# EAGLE design encoder (EAGLE 6.4)
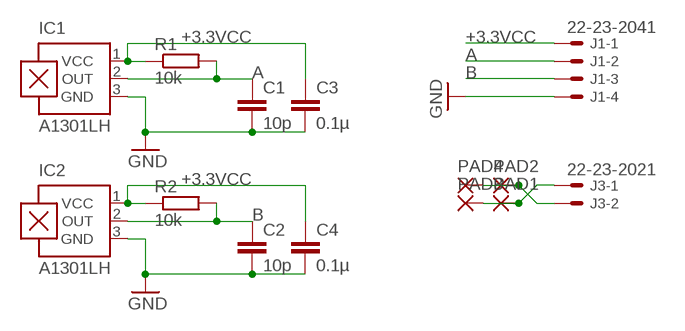
[diagram p0: schematic, sheet 1]

## Parts
C1  10p  C-EUC0805  [C0805]
C2  10p  C-EUC0805  [C0805]
C3  0.1µ  C-EUC0805  [C0805]
C4  0.1µ  C-EUC0805  [C0805]
IC1  A1301LH  [SOT23-W]
IC2  A1301LH  [SOT23-W]
J1  22-23-2041  [22-23-2041]
J3  22-23-2021  [22-23-2021]
PAD1  3,81/1,4  [3,81/1,4]
PAD2  3,81/1,4  [3,81/1,4]
PAD3  3,81/1,4  [3,81/1,4]
PAD4  3,81/1,4  [3,81/1,4]
R1  10k  R-EU_R0805  [R0805]
R2  10k  R-EU_R0805  [R0805]

## Nets
+3.3VCC: C3.1 C4.1 IC1.1(VCC) IC2.1(VCC) J1.1 R1.1 R2.1
A: C1.1 IC1.2(OUT) J1.2 R1.2
B: C2.1 IC2.2(OUT) J1.3 R2.2
GND: C1.2 C2.2 C3.2 C4.2 IC1.3(GND) IC2.3(GND) J1.4
N$9: J3.1 PAD1.1(P) PAD3.1(P)
N$17: J3.2 PAD2.1(P) PAD4.1(P)

## Library data of the parts
C1-C4 = rcl:C-EU: CAPACITOR, European symbol
IC1 IC2 = allegro:A13*?: Linear Hall Effect Sensor ICs Continuous-Time Ratiometric High-Temperature Operation Programmable Linear with Analog Output A1302 -Replacement- UGN3503 Source: http://www.allegromicro.com/en/Products/Part_Numbers/1301/1301.pdf http://www.allegromicro.com/en/Products/Part_Numbers/1321/1321.pdf http://www.allegromicro.com/en/Products/Part_Numbers/1381/1381.pdf; MF: ALLEGRO MICROSYSTEMS, INC.; MPN: A1301ELHLT-T; OC_FARNELL: 1198084; OC_NEWARK: 31K6634
J1 = con-molex:22-23-2041: .100" (2.54mm) Center Header - 4 Pin; MF: MOLEX; MPN: 22-23-2041; OC_FARNELL: 1462920; OC_NEWARK: 38C0355
J3 = con-molex:22-23-2021: .100" (2.54mm) Center Header - 2 Pin; MF: MOLEX; MPN: 22-23-2021; OC_FARNELL: 1462926; OC_NEWARK: 25C3832
PAD1-PAD4 = wirepad:3,81/1,4: THROUGH-HOLE PAD
R1 R2 = rcl:R-EU_: RESISTOR, European symbol

## Net classes
0 default: clearance 0.355 mm

## Board
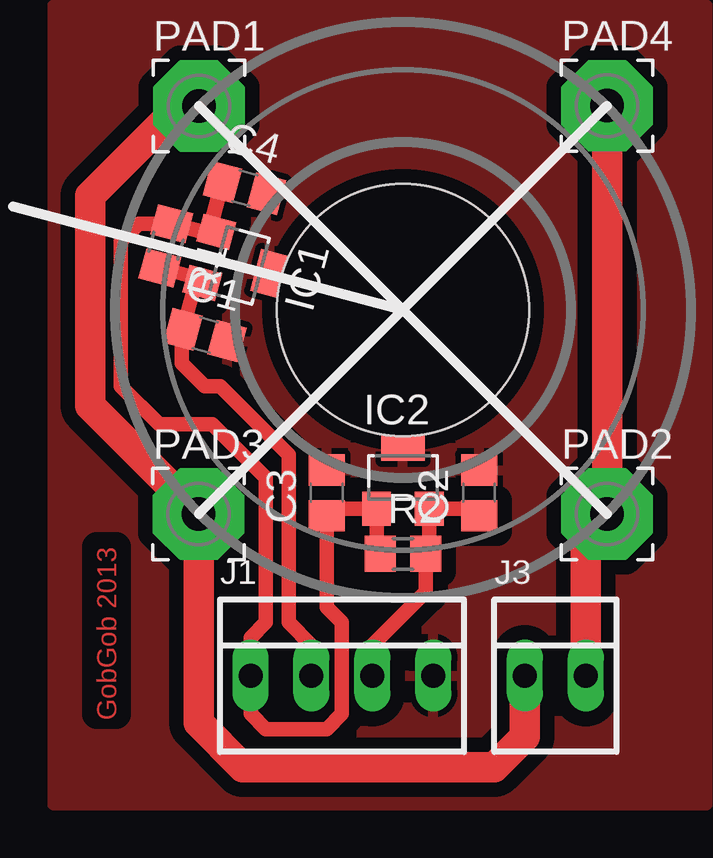
[diagram p1: board, top side]

No outline drawn. Coordinates in mm, seen from the top.
Copper layers (1*2*15*16): Top 0.035mm / dielectric 0.2mm / Route2 0.0175mm / dielectric 1.1mm / Route15 0.0175mm / dielectric 0.2mm / Bottom 0.035mm
Design rules "SeeedStudio_DRU_no_angle_20130527": minimum track width 6mil, minimum drill 12mil, track to track 6mil, track to pad 6mil, pad to pad 6mil, via to via 6mil, smd to smd 0mil, copper to edge 10mil, drill to drill 10mil, minimum pad ring 6mil, minimum via ring 6mil, stop-mask expansion 2mil, vias tented up to drill 25mil, thermal gap 10mil
Holes 10.5 mm at 1.27,-6.35

### Footprints (pad centres in the part's own frame; a part is rotated, then mirrored left to right if it is on the bottom)
C0805 = smd 1.3 x 1.5: 1 -0.95,0; 2 0.95,0
SOT23-W = smd 1.2 x 1.4: 1 -1.1,-1.3; 2 1.1,-1.3 | smd 1.8 x 1.2: 3 0,1.3
22-23-2041 = drill 1 long: 1 -3.81,0; 2 -1.27,0; 3 1.27,0; 4 3.81,0
22-23-2021 = drill 1 long: 1 -1.27,0; 2 1.27,0
3,81/1,4 = drill 1.397 pad 3.81 octagon: 1 0,0
R0805 = smd 1.3 x 1.5: 1 -0.95,0; 2 0.95,0

### Placement (x,y rotation side)
C1  -6.98,-7.4 345 top
C2  4.45,-13.97 90 top
C3  -1.91,-13.97 90 top
C4  -5.33,-1.27 345 top
IC1  -5.54,-4.5 255 top
IC2  1.27,-13.34 0 top
J1  -1.27,-21.59 0 top
J3  7.62,-21.59 0 top
PAD1  -7.23,2.15 0 top
PAD2  9.78,-14.86 0 top
PAD3  -7.24,-14.86 0 top
PAD4  9.78,2.16 0 top
R1  -8.61,-3.68 255 top
R2  1.27,-16.51 0 top

### Tracks (layer width: path | path; a pad name or v marks a point on that pad's centre or on a via)
+3.3VCC
  Top 0.61: R2.1 0.17,-16.36 IC2.1 -1.62,-14.63 C3.1 -1.91,-18.73 -1.27,-19.37 -1.27,-23.18 -1.91,-23.81 -4.45,-23.81 -5.08,-23.18 J1.1 -5.08,-20 -4.45,-19.37 -4.45,-13.34 -6.67,-11.11 -8.89,-11.11 -10.48,-9.53 -10.48,-3.49 -9.74,-2.76 R1.1 | C4.1 -6.71,-2.75 IC1.1 -6.7,-3.21 | R1.1 -6.7,-3.21 | -6.7,-3.21 -6.7,-2.51 | -8.58,-2.54 R1.1
A
  Top 0.61: R1.2 -7.19,-5.04 IC1.2 -7.43,-5.43 C1.1 -7.94,-7.2 -7.94,-8.57 -6.99,-9.53 -6.35,-9.53 -3.49,-12.38 -3.49,-19.37 -2.54,-20.32 J1.2
B
  Top 0.61: C2.1 4.16,-14.63 IC2.2 2.37,-16.36 R2.2 2.22,-18.1 0,-20.32 J1.3
GND
  pour Top (isolate 0.61): -13.34,6.35 -13.34,-26.99 13.97,-26.99 13.97,6.35
N$9
  Top 1.27: PAD1.1 -8.01,2.15 -11.75,-1.59 -11.75,-10.35 PAD3.1 -7.24,-23.56 -5.4,-25.4 5.08,-25.4 6.35,-24.13 J3.1
N$17
  Top 1.27: J3.2 8.89,-15.75 PAD2.1 PAD4.1

### Text on the board
Top: GobGob 2013
_tNames: C4 | IC1 | R1 | C1 | IC2 | C3 | R2 | C2 | JP1